# Altium schematic sheet FullBridge.SchDoc
size A4; Author: Luis Henrique DAvila Possatti; Organization: University of Campinas
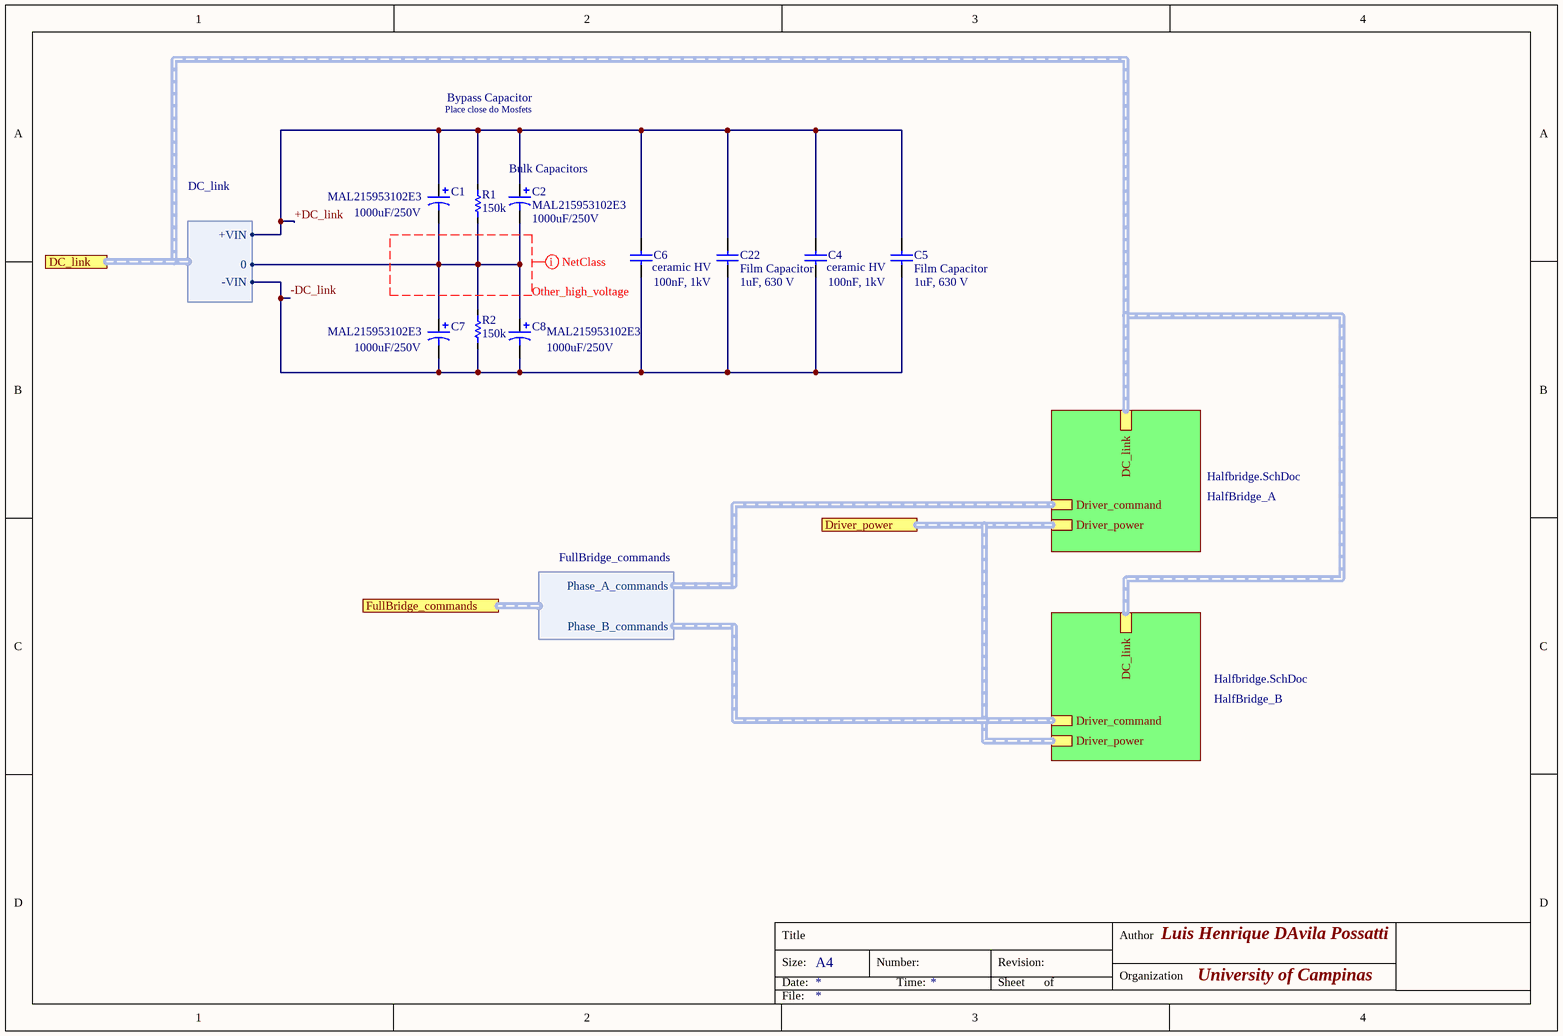
[diagram p0: FullBridge.SchDoc]

## Parts
C1  MAL215953102E3  value 1000uF/250V  [Radial 35D40H10P]
C2  MAL215953102E3  value 1000uF/250V  [Radial 35D40H10P]
C4  ceramic HV  value 100nF, 1kV  [CAPACITOR 1812]
C5  Film Capacitor  value 1uF, 630 V  [MIXED Film Capacitors]
C6  ceramic HV  value 100nF, 1kV  [CAPACITOR 1812]
C7  MAL215953102E3  value 1000uF/250V  [Radial 35D40H10P]
C8  MAL215953102E3  value 1000uF/250V  [Radial 35D40H10P]
C22  Film Capacitor  value 1uF, 630 V  [MIXED Film Capacitors]
R1  value 150k  [Resistor 2512]  (hidden comment: CRCW2512150KFKEG)
R2  value 150k  [Resistor 2512]  (hidden comment: CRCW2512150KFKEG)

## Sub-sheets
HalfBridge_A = Halfbridge.SchDoc: Driver_command (harness Driver_input_connections), Driver_power (harness PowerSupplyOutputs), DC_link (harness DC_link)
HalfBridge_B = Halfbridge.SchDoc: Driver_command (harness Driver_input_connections), Driver_power (harness PowerSupplyOutputs), DC_link (harness DC_link)

## Ports
DC_link (harness DC_link), Driver_power (harness PowerSupplyOutputs), FullBridge_commands (harness FullBridge_commands)

## Harnesses
FullBridge_commands: Phase_A_commands, Phase_B_commands
DC_link: +VIN, -VIN, 0

## Nets
+DC_link: C1.1 C2.1 C4.1 C5.1 C6.1 C22.1 R1.2 ; port DC_link.+VIN
-DC_link: C4.2 C5.2 C6.2 C7.2 C8.2 C22.2 R2.1 ; port DC_link.-VIN
NetC1_2: C1.2 C2.2 C7.1 C8.1 R1.1 R2.2 ; port DC_link.0

## Buses and harness runs
harness port DC_link = sheet HalfBridge_A/DC_link = sheet HalfBridge_B/DC_link
harness port Driver_power = sheet HalfBridge_A/Driver_power = sheet HalfBridge_B/Driver_power

## Layout directives
net class Other_high_voltage: (no net found under the mark)

## Notes on the sheet
- Place close do Mosfets
- Bypass Capacitor
- Bulk Capacitors
- Title
- Size:
- Date:
- A4
- Number:
- Time:
- Revision:
- Sheet
- of
- Author
- Organization
- File:

## Library data of the parts
C1 C2 C7 C8 = MAL215953102E3: Aluminum Electrolytic Capacitor 1000UF 20% 250V SNAP; pn: MAL215953102E3; ClassName: strong_connection
C4 C6 = Capacitor ceramic High Voltage: High Voltage Ceramic SMD capacitor, two part numbers, 100nF; pn: C1210C104KBRAC7800, C1812C104KDRAC7800; ClassName: strong_connection
C5 C22 = Capacitor Metalized Film: Metalized Film Capacitor, two part numbers; pn: PHE844RR7100MR06L2 ,B32794D2106K; ClassName: strong_connection
R1 R2 = CRCW2512150KFKEG: SMD resistor 2512, 150kOhm; pn: CRCW2512150KFKEG